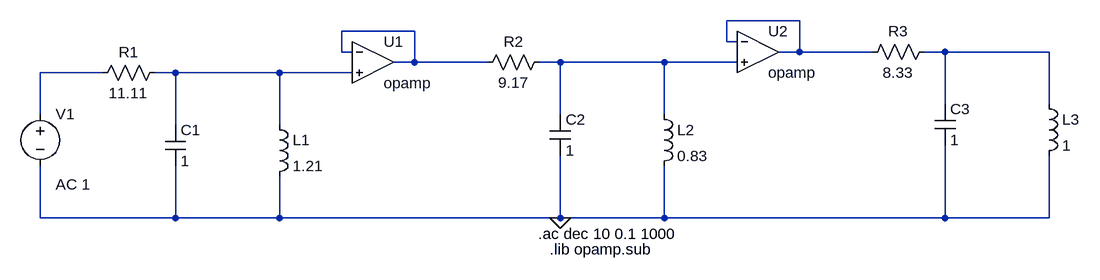
[diagram p0: schematic TS4.asc]
TS4.asc, the LTspice schematic file:
Version 4
SHEET 1 880 680
WIRE 368 0 256 0
WIRE -224 16 -336 16
WIRE 256 32 256 0
WIRE 272 32 256 32
WIRE -336 48 -336 16
WIRE -320 48 -336 48
WIRE 368 48 368 0
WIRE 368 48 336 48
WIRE 480 48 368 48
WIRE 592 48 560 48
WIRE 752 48 592 48
WIRE -224 64 -224 16
WIRE -224 64 -256 64
WIRE -112 64 -224 64
WIRE 0 64 -32 64
WIRE 160 64 0 64
WIRE 272 64 160 64
WIRE -704 80 -800 80
WIRE -592 80 -624 80
WIRE -432 80 -592 80
WIRE -320 80 -432 80
WIRE 592 128 592 48
WIRE 752 128 752 48
WIRE -800 144 -800 80
WIRE 0 144 0 64
WIRE 160 144 160 64
WIRE -592 160 -592 80
WIRE -432 160 -432 80
WIRE -800 304 -800 224
WIRE -592 304 -592 224
WIRE -592 304 -800 304
WIRE -432 304 -432 240
WIRE -432 304 -592 304
WIRE 0 304 0 208
WIRE 0 304 -432 304
WIRE 160 304 160 224
WIRE 160 304 0 304
WIRE 592 304 592 192
WIRE 592 304 160 304
WIRE 752 304 752 208
WIRE 752 304 592 304
FLAG 0 304 0
SYMBOL res -608 64 R90
WINDOW 0 0 56 VBottom 2
WINDOW 3 32 56 VTop 2
SYMATTR InstName R1
SYMATTR Value 11.11
SYMBOL ind -448 144 R0
SYMATTR InstName L1
SYMATTR Value 1.21
SYMBOL cap -608 160 R0
SYMATTR InstName C1
SYMATTR Value 1
SYMBOL voltage -800 128 R0
WINDOW 123 24 124 Left 2
WINDOW 39 0 0 Left 0
SYMATTR InstName V1
SYMATTR Value ""
SYMATTR Value2 AC 1
SYMBOL OpAmps\\opamp -288 0 R0
SYMATTR InstName U1
SYMBOL res -16 48 R90
WINDOW 0 0 56 VBottom 2
WINDOW 3 32 56 VTop 2
SYMATTR InstName R2
SYMATTR Value 9.17
SYMBOL ind 144 128 R0
SYMATTR InstName L2
SYMATTR Value 0.83
SYMBOL cap -16 144 R0
SYMATTR InstName C2
SYMATTR Value 1
SYMBOL OpAmps\\opamp 304 -16 R0
SYMATTR InstName U2
SYMBOL res 576 32 R90
WINDOW 0 0 56 VBottom 2
WINDOW 3 32 56 VTop 2
SYMATTR InstName R3
SYMATTR Value 8.33
SYMBOL ind 736 112 R0
SYMATTR InstName L3
SYMATTR Value 1
SYMBOL cap 576 128 R0
SYMATTR InstName C3
SYMATTR Value 1
TEXT -34 328 Left 2 !.ac dec 10 0.1 1000
TEXT -16 352 Left 2 !.lib opamp.sub

The netlist it stands for:
* TS4.asc
R1 N006 N005 11.11
L1 N006 0 1.21
C1 N006 0 1
V1 N005 0 AC 1
XU1 N002 N006 N002 opamp Aol=100K GBW=10Meg  ; pins invin noninvin out
R2 N004 N002 9.17
L2 N004 0 0.83
C2 N004 0 1
XU2 N001 N004 N001 opamp Aol=100K GBW=10Meg  ; pins invin noninvin out
R3 N003 N001 8.33
L3 N003 0 1
C3 N003 0 1
.ac dec 10 0.1 1000
.lib opamp.sub
.backanno
.end